# EAGLE design IN-12B breakout (EAGLE 7.7.0)
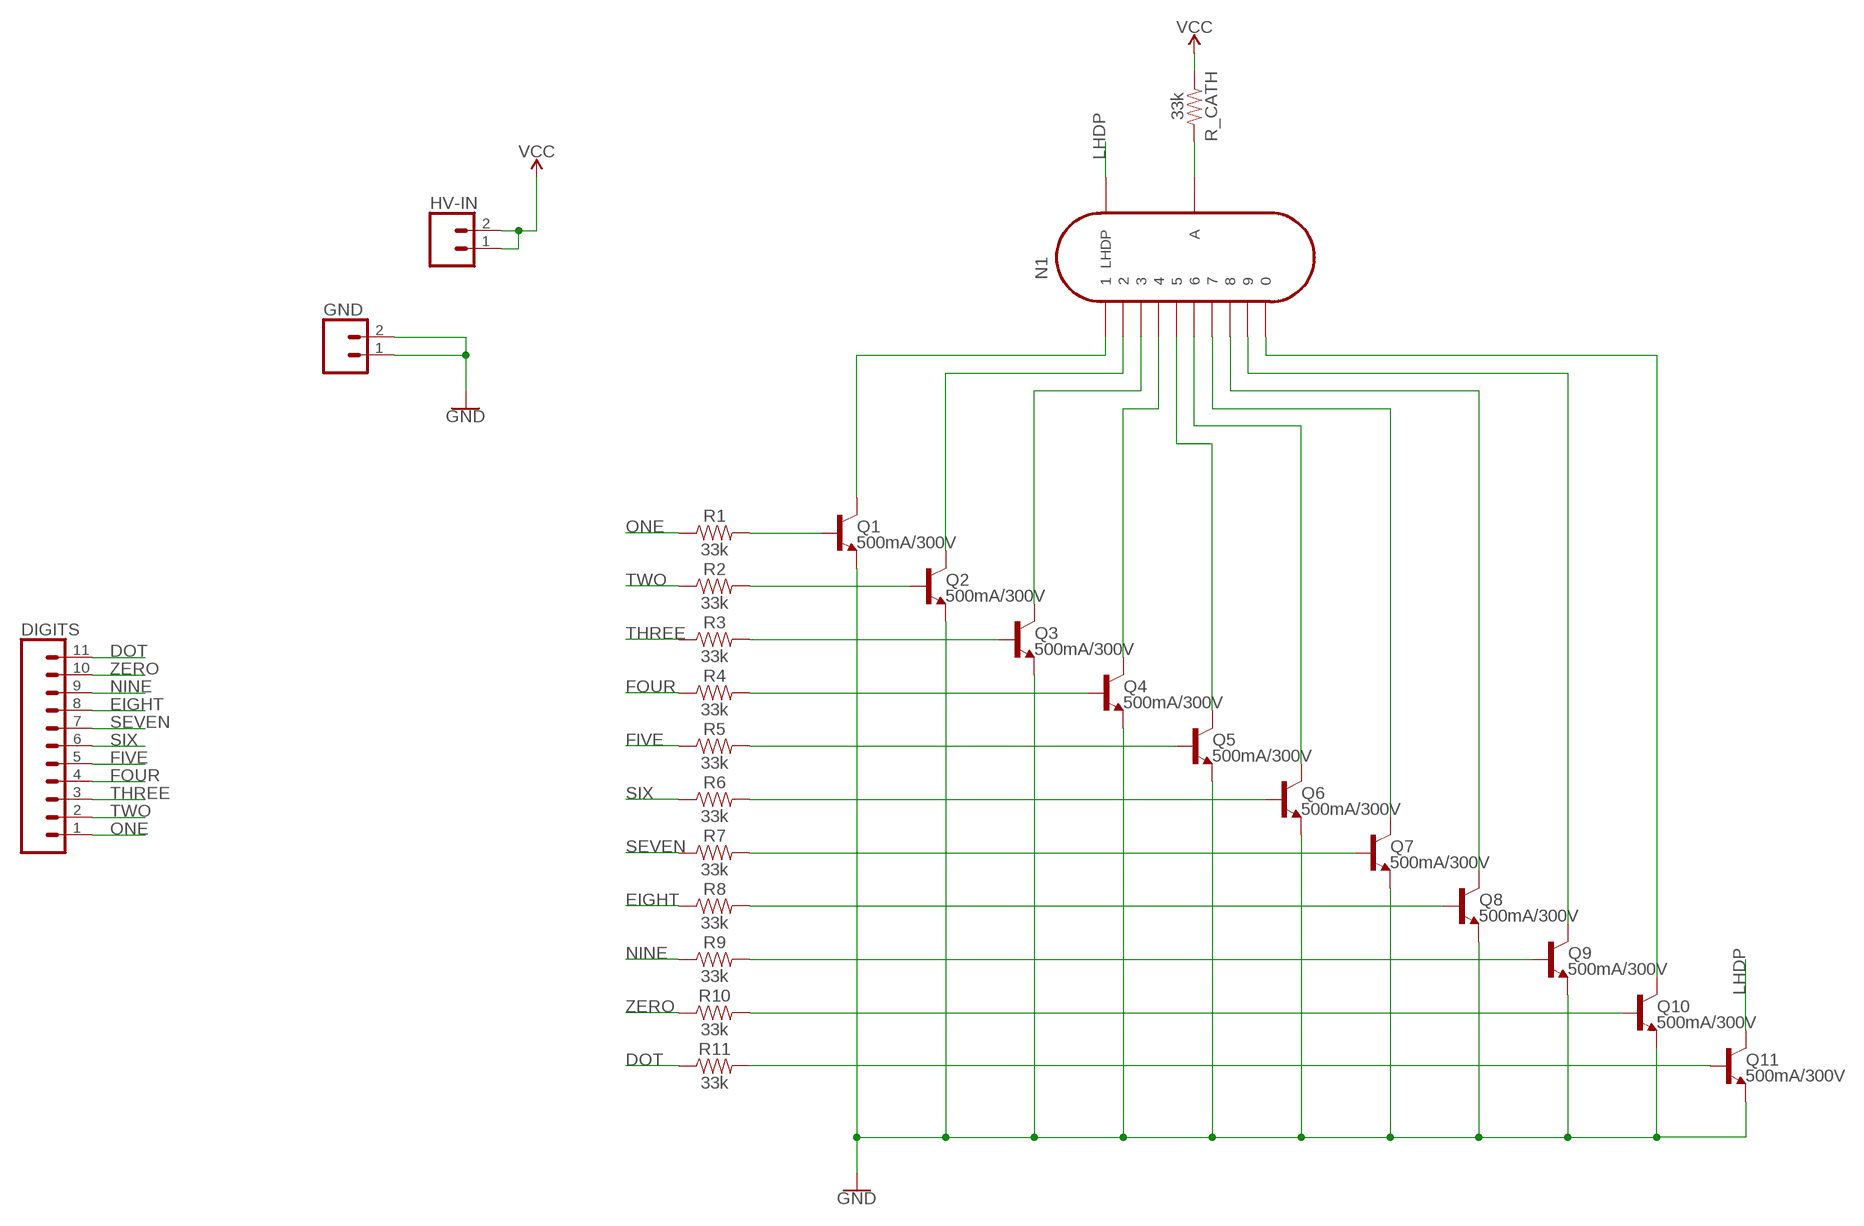
[diagram p0: schematic, sheet 1]

## Parts
DIGITS  CONN_11  [1X11]
GND  CONN_02  [1X02]
HV-IN  CONN_02  [1X02]
N1  IN-12B  [IN-12]
Q1  500mA/300V  TRANS_NPN-MMBTA42  [SOT23-3]
Q2  500mA/300V  TRANS_NPN-MMBTA42  [SOT23-3]
Q3  500mA/300V  TRANS_NPN-MMBTA42  [SOT23-3]
Q4  500mA/300V  TRANS_NPN-MMBTA42  [SOT23-3]
Q5  500mA/300V  TRANS_NPN-MMBTA42  [SOT23-3]
Q6  500mA/300V  TRANS_NPN-MMBTA42  [SOT23-3]
Q7  500mA/300V  TRANS_NPN-MMBTA42  [SOT23-3]
Q8  500mA/300V  TRANS_NPN-MMBTA42  [SOT23-3]
Q9  500mA/300V  TRANS_NPN-MMBTA42  [SOT23-3]
Q10  500mA/300V  TRANS_NPN-MMBTA42  [SOT23-3]
Q11  500mA/300V  TRANS_NPN-MMBTA42  [SOT23-3]
R1  33k  33KOHM-0603-1/10W-1%  [0603]
R2  33k  33KOHM-0603-1/10W-1%  [0603]
R3  33k  33KOHM-0603-1/10W-1%  [0603]
R4  33k  33KOHM-0603-1/10W-1%  [0603]
R5  33k  33KOHM-0603-1/10W-1%  [0603]
R6  33k  33KOHM-0603-1/10W-1%  [0603]
R7  33k  33KOHM-0603-1/10W-1%  [0603]
R8  33k  33KOHM-0603-1/10W-1%  [0603]
R9  33k  33KOHM-0603-1/10W-1%  [0603]
R10  33k  33KOHM-0603-1/10W-1%  [0603]
R11  33k  33KOHM-0603-1/10W-1%  [0603]
R_CATH  33k  33KOHM-0603-1/10W-1%  [0603]

## Nets
DOT: DIGITS.11 R11.1
EIGHT: DIGITS.8 R8.1
FIVE: DIGITS.5 R5.1
FOUR: DIGITS.4 R4.1
GND: GND.1 GND.2 Q1.2(E) Q2.2(E) Q3.2(E) Q4.2(E) Q5.2(E) Q6.2(E) Q7.2(E) Q8.2(E) Q9.2(E) Q10.2(E) Q11.2(E)
LHDP: N1.LHDP Q11.3(C)
N$1: Q1.1(B) R1.2
N$2: Q2.1(B) R2.2
N$3: Q3.1(B) R3.2
N$4: Q4.1(B) R4.2
N$5: Q5.1(B) R5.2
N$6: Q6.1(B) R6.2
N$7: Q7.1(B) R7.2
N$8: Q8.1(B) R8.2
N$9: Q9.1(B) R9.2
N$10: Q10.1(B) R10.2
N$11: N1.1 Q1.3(C)
N$12: N1.2 Q2.3(C)
N$13: N1.3 Q3.3(C)
N$14: N1.4 Q4.3(C)
N$15: N1.5 Q5.3(C)
N$16: N1.6 Q6.3(C)
N$17: N1.7 Q7.3(C)
N$18: N1.8 Q8.3(C)
N$19: N1.9 Q9.3(C)
N$20: N1.0 Q10.3(C)
N$21: N1.A R_CATH.2
N$22: Q11.1(B) R11.2
NINE: DIGITS.9 R9.1
ONE: DIGITS.1 R1.1
SEVEN: DIGITS.7 R7.1
SIX: DIGITS.6 R6.1
THREE: DIGITS.3 R3.1
TWO: DIGITS.2 R2.1
VCC: HV-IN.1 HV-IN.2 R_CATH.1
ZERO: DIGITS.10 R10.1

## Library data of the parts
DIGITS = SparkFun-Connectors:CONN_11: Multi connection point. Often used as Generic Header-pin footprint for 0.1 inch spaced/style header connections On any of the 0.1 inch spaced packages, you can populate with these: Break Away Headers - Straight <https://www.sparkfun.com/products/116> (PRT-00116) Break Away Male Headers - Right Angle <https://www.sparkfun.com/products/553> (PRT-00553) Female Headers <https://www.sparkfun.com/products/115> (PRT-00115) Break Away Headers - Machine Pin <https://www.sparkfun.com/products/117> (PRT-00117) Break Away Female Headers - Swiss Machine Pin <https://www.sparkfun.com/products/743> (PRT-00743) For SCREWTERMINALS and SPRING TERMINALS visit here: Screw Terimnals on SparkFun.com <https://www.sparkfun.com/search/results?term=Screw+Terminals> (5mm/3.5mm/2.54mm spacing) This device is also useful as a general connection point to wire up your design to another part of your project. Our various solder wires solder well into these plated through hole pads. Hook-Up Wire - Assortment (Stranded, 22 AWG) <https://www.sparkfun.com/products/11375> (PRT-11375) Hook-Up Wire - Assortment (Solid Core, 22 AWG) <https://www.sparkfun.com/products/11367> (PRT-11367) View the entire wire category on our website here <https://www.sparkfun.com/categories/141>
GND HV-IN = SparkFun-Connectors:CONN_02: Multi connection point. Often used as Generic Header-pin footprint for 0.1 inch spaced/style header connections On any of the 0.1 inch spaced packages, you can populate with these: Break Away Headers - Straight <https://www.sparkfun.com/products/116> (PRT-00116) Break Away Male Headers - Right Angle <https://www.sparkfun.com/products/553> (PRT-00553) Female Headers <https://www.sparkfun.com/products/115> (PRT-00115) Break Away Headers - Machine Pin <https://www.sparkfun.com/products/117> (PRT-00117) Break Away Female Headers - Swiss Machine Pin <https://www.sparkfun.com/products/743> (PRT-00743) For SCREWTERMINALS and SPRING TERMINALS visit here: Screw Terimnals on SparkFun.com <https://www.sparkfun.com/search/results?term=Screw+Terminals> (5mm/3.5mm/2.54mm spacing) This device is also useful as a general connection point to wire up your design to another part of your project. Our various solder wires solder well into these plated through hole pads. Hook-Up Wire - Assortment (Stranded, 22 AWG) <https://www.sparkfun.com/products/11375> (PRT-11375) Hook-Up Wire - Assortment (Solid Core, 22 AWG) <https://www.sparkfun.com/products/11367> (PRT-11367) View the entire wire category on our website here <https://www.sparkfun.com/categories/141> Special notes: Molex polarized connector foot print use with: PRT-08233 with associated crimp pins and housings. 2.54_SCREWTERM for use with PRT-10571. 3.5mm Screw Terminal footprints for PRT-08084 5mm Screw Terminal footprints for use with PRT-08432
N1 = russian-nixies:IN-12B: IN-12B: medium numeric topview nixie tube
Q1-Q11 = SparkFun-DiscreteSemi:TRANS_NPN: NPN transistor Current controlled devices typically used to amplify current or used as a switch. BC547 - COM-08928 <http://www.sparkfun.com/products/8928> (TO-92 45V 100mA) (1.Collector 2.Base 3.Emitter) 2N3904 - COM-00521 <http://www.sparkfun.com/products/521> (TO-92 40V 200mA) (1.Emitter 2.Base 3.Collector) P2N2222A - COM-12852 <http://www.sparkfun.com/products/12852> (TO-92 40V 600mA) (1.Collector 2.Base 3.Emitter); PROD_ID: TRANS-09116
R1-R11 R_CATH = SparkFun-Resistors:33KOHM: 33kΩ resistor A resistor is a passive two-terminal electrical component that implements electrical resistance as a circuit element. Resistors act to reduce current flow, and, at the same time, act to lower voltage levels within circuits. - Wikipedia; PROD_ID: RES-08416

## Board
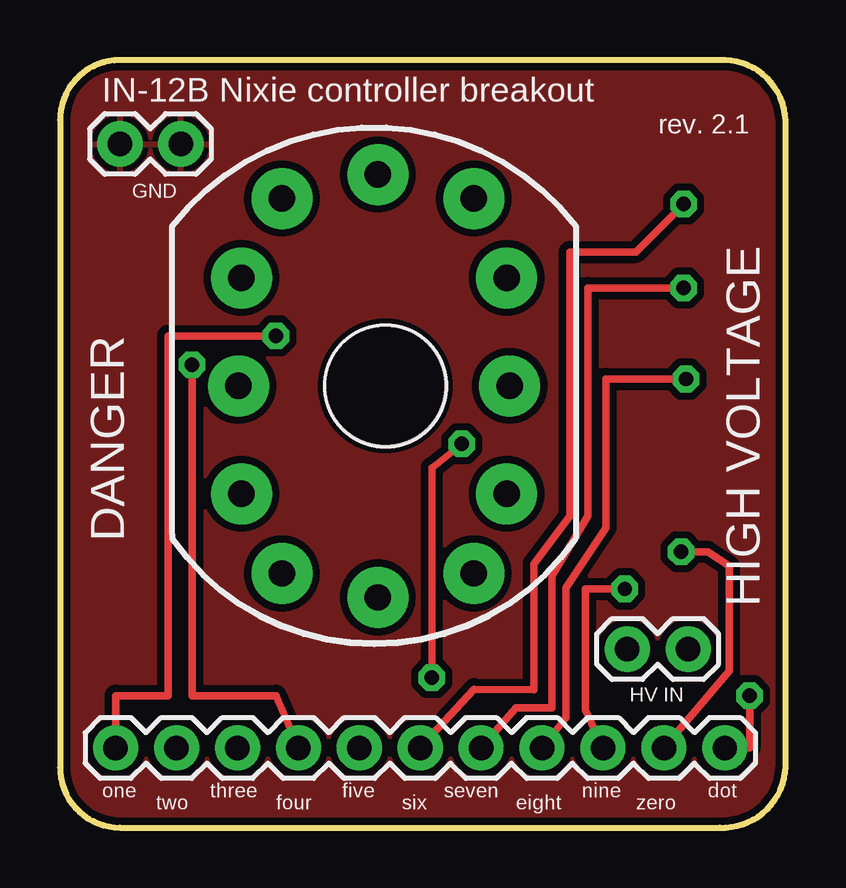
[diagram p1: board, top side]
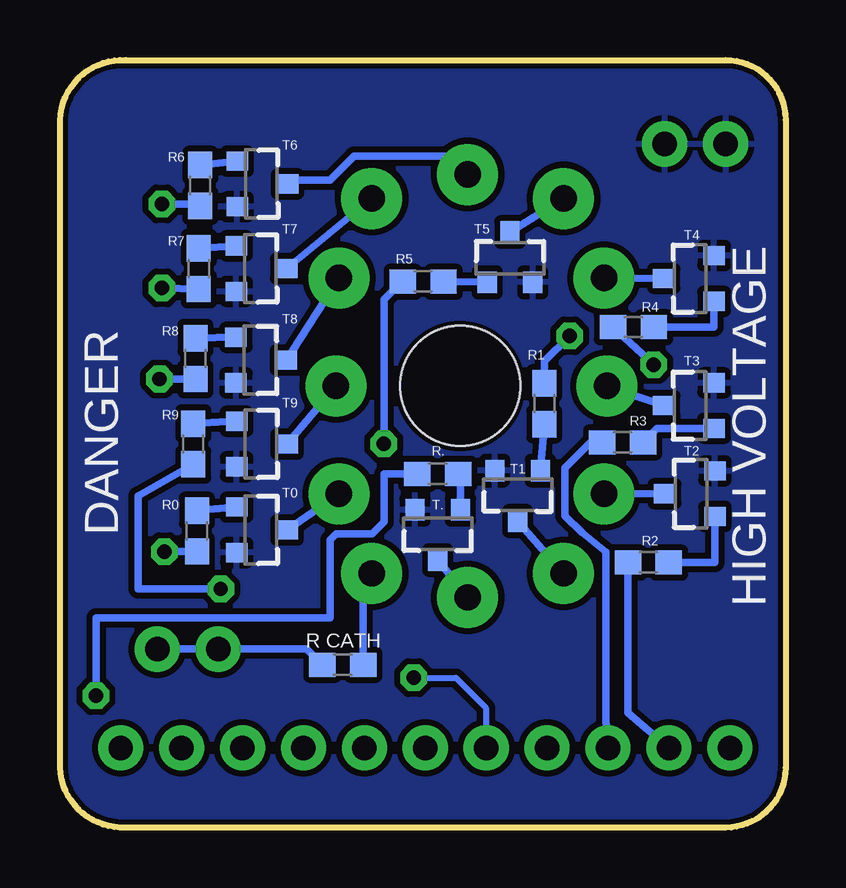
[diagram p2: board, bottom side, seen from below]

Size 30.25 x 32 mm. Coordinates in mm from the lower left corner, seen from the top.
Outline: 2.5,0 27.5,0 arc90 30.25,2.5 30.25,29.5 arc90 27.5,32 2.5,32 arc90 0,29.5 0,2.5 arc90 2.5,0
Copper layers (1*16): Top 0.035mm / dielectric 1.5mm / Bottom 0.035mm
Design rules "SparkFun-2-layer-STANDARD *": minimum track width 10mil, minimum drill 20mil, track to track 10mil, track to pad 8mil, pad to pad 8mil, via to via 10mil, smd to smd 8mil, copper to edge 8mil, drill to drill 8mil, minimum pad ring 10mil, minimum via ring 10mil, stop-mask expansion 4mil, vias tented up to drill 25mil, thermal gap 10mil

### Footprints (pad centres in the part's own frame; a part is rotated, then mirrored left to right if it is on the bottom)
1X11 = drill 1.016 pad 1.88: 1 0,0; 2 2.54,0; 3 5.08,0; 4 7.62,0; 5 10.16,0; 6 12.7,0; 7 15.24,0; 8 17.78,0; 9 20.32,0; 10 22.86,0; 11 25.4,0
1X02 = drill 1.016 pad 1.88: 1 0,0; 2 2.54,0
IN-12 = drill 1.1 pad 2.54: 0 5.048,-4.5; 1 -4.317,-7.817; 2 -6,-4.5; 3 -6.127,0; 4 -6,4.5; 5 -4.317,7.817; 6 -0.318,8.818; 7 3.683,7.817; 8 5.048,4.5; 9 5.175,0; A 3.683,-7.817; LHDP -0.318,-8.818 | hole 5: 0,0
SOT23-3 = smd 0.8 x 0.9: 1 -0.95,-1; 2 0.95,-1; 3 0,1.1
0603 = smd 1.1 x 1: 1 -0.85,0; 2 0.85,0

### Placement (x,y rotation side)
DIGITS  2.32,3.32 0 top
GND  2.5,28.5 0 top
HV-IN  26.19,7.44 180 top
N1  13.57,18.41 0 top
Q1  11.17,13.88 180 bottom
Q2  3.94,13.92 90 bottom
Q3  3.98,17.59 90 bottom
Q4  3.98,22.89 90 bottom
Q5  11.49,23.73 0 bottom
Q6  21.86,26.83 270 bottom
Q7  21.9,23.3 270 bottom
Q8  21.91,19.49 270 bottom
Q9  21.88,15.99 270 bottom
Q10  21.88,12.41 270 bottom
Q11  14.5,12.25 180 bottom
R1  10.06,17.67 270 bottom
R2  5.72,11.05 0 bottom
R3  6.79,16.06 0 bottom
R4  6.34,20.86 0 bottom
R5  15.11,22.76 0 bottom
R6  24.4,26.77 90 bottom
R7  24.46,23.3 90 bottom
R8  24.6,19.55 90 bottom
R9  24.69,15.99 90 bottom
R10  24.54,12.36 90 bottom
R11  14.5,14.75 0 bottom
R_CATH  18.46,6.79 0 bottom

### Tracks (layer width: path | path; a pad name or v marks a point on that pad's centre or on a via)
DOT  (via drill 0.6)
  Top 0.305: v28.75,5.5 28.75,3.32 DIGITS.11
  Bottom 0.305: R11.1 16.75,14.75 16.75,12.75 17.25,12.25 18.75,12.25 19,12 19,8.75 28.75,8.75 v28.75,5.5
EIGHT  (via drill 0.6)
  Top 0.305: v26.1,18.7 22.75,18.7 22.75,12.5 21.1,10 21.1,4.57 DIGITS.8
  Bottom 0.305: v26.1,18.7 R8.1
FIVE  (via drill 0.6)
  Top 0.305: v15.5,6.25 15.5,15 v16.75,16
  Bottom 0.254: v15.5,6.25 13.75,6.25 12.5,5 DIGITS.5
  Bottom 0.305: v16.75,16 16.75,22.01 R5.1
FOUR  (via drill 0.6)
  Top 0.305: v5.5,19.3 5.5,5.5 9.01,5.5 DIGITS.4
  Bottom 0.305: v5.5,19.3 R4.1
GND
  pour Top (isolate 0.305): -3,33 33.25,33 33.25,-3 -3,-3
  pour Bottom: -3,33 33.25,33 33.25,-3 -3,-3
LHDP
  Bottom 0.305: Q11.3 N1.LHDP
N$1
  Bottom 0.305: Q1.1 R1.2
N$2
  Bottom 0.305: R2.2 2.94,11.05 Q2.1
N$3
  Bottom 0.305: R3.2 5.36,16.64 Q3.1
N$4
  Bottom 0.305: R4.2 2.98,20.86 Q4.1
N$5
  Bottom 0.305: R5.2 Q5.1
N$6
  Bottom 0.305: Q6.1 R6.2
N$7
  Bottom 0.305: Q7.1 R7.2
N$8
  Bottom 0.305: Q8.1 R8.2
N$9
  Bottom 0.305: Q9.1 R9.2
N$10
  Bottom 0.305: Q10.1 R10.2
N$11
  Bottom 0.305: N1.1 Q1.3
N$12
  Bottom 0.305: N1.2 Q2.3
N$13
  Bottom 0.305: N1.3 Q3.3
N$14
  Bottom 0.305: N1.4 Q4.3
N$15
  Bottom 0.305: N1.5 Q5.3
N$16
  Bottom 0.305: Q6.3 20.5,27 19,27 18,28 14,28 13.5,27.5 N1.6
N$17
  Bottom 0.305: N1.7 Q7.3
N$18
  Bottom 0.305: N1.8 Q8.3
N$19
  Bottom 0.305: N1.9 Q9.3
N$20
  Bottom 0.305: N1.0 Q10.3
N$21
  Bottom 0.305: N1.A 17.61,10.24 R_CATH.2
N$22
  Bottom 0.305: R11.2 13.55,14.75 Q11.1
NINE  (via drill 0.6)
  Top 0.305: DIGITS.9 21.9,4.91 21.9,9.95 v23.55,9.95
  Bottom 0.305: R9.1 27,13.83 27,9.95 v23.55,9.95
ONE  (via drill 0.6)
  Top 0.305: DIGITS.1 2.32,5.5 4.5,5.5 4.5,20.5 v9,20.5
  Bottom 0.305: v9,20.5 10.06,19.44 R1.1
SEVEN  (via drill 0.6)
  Top 0.305: v26,22.5 22,22.5 22,13 20.5,10.5 20.5,5 19,5 DIGITS.7
  Bottom 0.305: v26,22.5 R7.1
SIX  (via drill 0.6)
  Top 0.305: DIGITS.6 17.27,5.77 19.75,5.75 19.75,11 21.25,13 21.25,24 24,24 v26,26
  Bottom 0.305: v26,26 24.48,26 R6.1
THREE
  Bottom 0.305: R3.1 8.14,16.06 9.2,15 9.2,13 8.5,12.3 7.5,11.5 7.5,4.47 DIGITS.3
TWO
  Bottom 0.305: DIGITS.2 6.57,4.78 R2.1
VCC
  Bottom 0.305: HV-IN.1 HV-IN.2 19.96,7.44 R_CATH.1
ZERO  (via drill 0.6)
  Top 0.305: DIGITS.10 27.9,6.54 27.9,10.9 27,11.5 v25.9,11.5
  Bottom 0.305: v25.9,11.5 25.49,11.51 R10.1

### Text on the board
tPlace: IN-12B Nixie controller breakout | rev. 2.1 | GND | HIGH VOLTAGE | DANGER | HV IN | one | two | three | four | five | six | seven | eight | nine | zero | dot
bPlace: T6 | R6 | T5 | T7 | HIGH VOLTAGE | T4 | R5 | R7 | R4 | T8 | DANGER | R1 | R8 | T3 | T9 | R3 | R9 | T2 | R. | T1 | T0 | T. | R0 | R2 | R CATH